# EAGLE schematic hw2 (EAGLE 7.5.0)
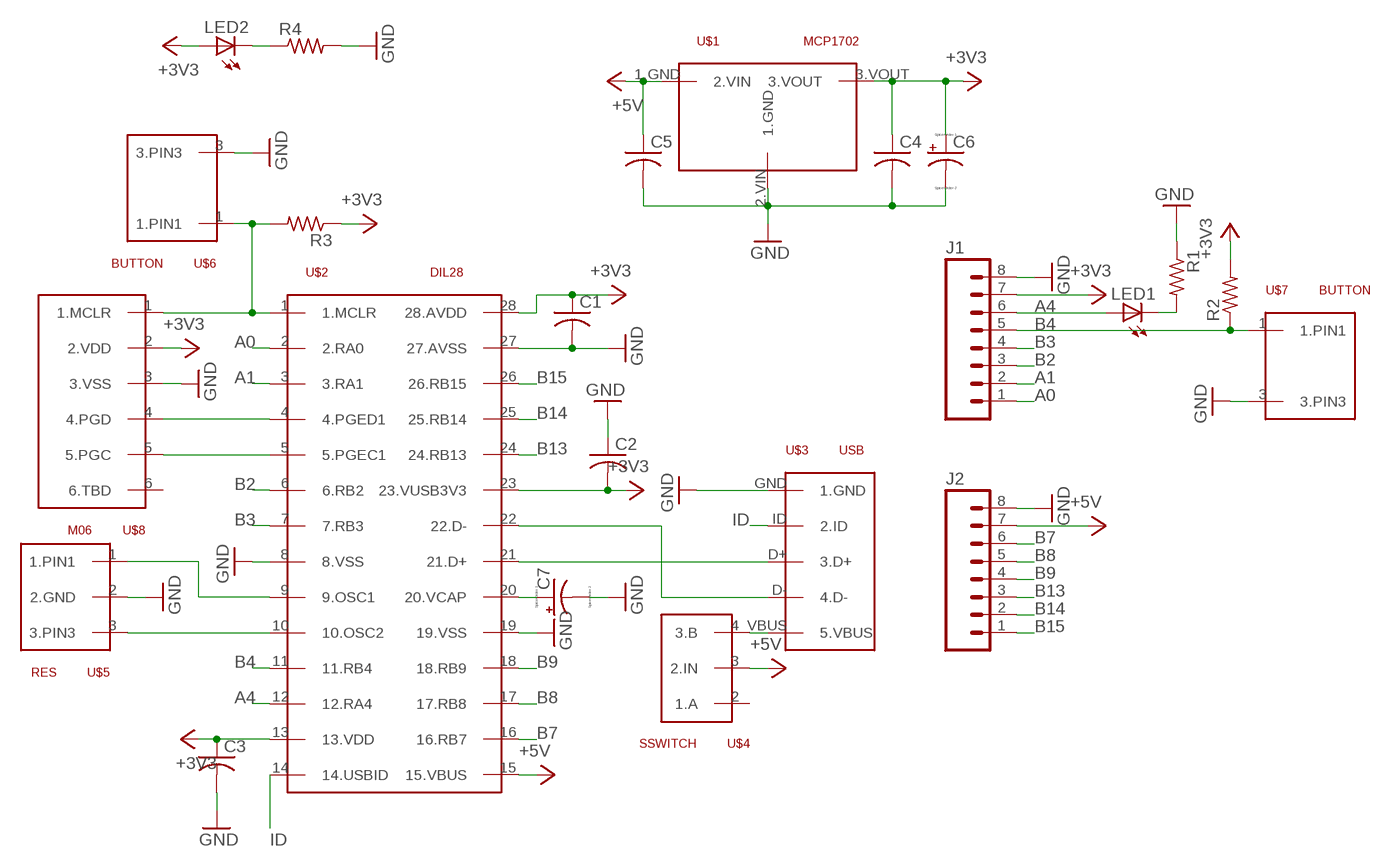
[diagram p0: schematic, sheet 1]

## Parts
C1  C-US025-025X050  [C025-025X050]
C2  C-US025-025X050  [C025-025X050]
C3  C-US025-025X050  [C025-025X050]
C4  C-US025-025X050  [C025-025X050]
C5  C-US025-025X050  [C025-025X050]
C6  CPOL-USTT2D4L  [TT2D4L]
C7  CPOL-USTT2D4L  [TT2D4L]
J1  M08  [1X08_ROUND]
J2  M08  [1X08_ROUND]
LED1  LED3MM  [LED3MM]
LED2  LED3MM  [LED3MM]
R1  R-US_0207/10  [0207/10]
R2  R-US_0207/10  [0207/10]
R3  R-US_0207/10  [0207/10]
R4  R-US_0207/10  [0207/10]
U$1  MCP1702  [TO92]
U$2  DIL28  [DIL28-3]
U$3  USB  [USB-MB-H]
U$4  SSWITCH  [SSWITCH]
U$5  RES  [1X03]
U$6  BUTTON  [BUTTON]
U$7  BUTTON  [BUTTON]
U$8  M06  [1X06]

## Nets
+3V3: C1.1 C2.2 C3.1 C4.1 C6.+ J1.7 LED2.A R2.2 R3.1 U$1.3.VOUT U$2.13(13.VDD) U$2.23(23.VUSB3V3) U$2.28(28.AVDD) U$8.2(2.VDD)
+5V: C5.1 J2.7 U$1.1.GND(2.VIN) U$2.15(15.VBUS) U$4.3(2.IN)
A0: J1.1 U$2.2(2.RA0)
A1: J1.2 U$2.3(3.RA1)
A4: J1.6 LED1.A U$2.12(12.RA4)
B2: J1.3 U$2.6(6.RB2)
B3: J1.4 U$2.7(7.RB3)
B4: J1.5 R2.1 U$2.11(11.RB4) U$7.1(1.PIN1)
B7: J2.6 U$2.16(16.RB7)
B8: J2.5 U$2.17(17.RB8)
B9: J2.4 U$2.18(18.RB9)
B13: J2.3 U$2.24(24.RB13)
B14: J2.2 U$2.25(25.RB14)
B15: J2.1 U$2.26(26.RB15)
GND: C1.2 C2.1 C3.2 C4.2 C5.2 C6.- C7.- J1.8 J2.8 R1.1 R4.2 U$1.2.VIN(1.GND) U$2.8(8.VSS) U$2.19(19.VSS) U$2.27(27.AVSS) U$3.GND(1.GND) U$5.2(2.GND) U$6.3(3.PIN3) U$7.3(3.PIN3) U$8.3(3.VSS)
ID: U$2.14(14.USBID) U$3.ID(2.ID)
N$1: LED1.K(C) R1.2
N$2: LED2.K(C) R4.1
N$3: U$2.9(9.OSC1) U$5.1(1.PIN1)
N$4: U$2.10(10.OSC2) U$5.3(3.PIN3)
N$5: C7.+ U$2.20(20.VCAP)
N$7: U$2.5(5.PGEC1) U$8.5(5.PGC)
N$8: U$2.4(4.PGED1) U$8.4(4.PGD)
N$9: R3.2 U$2.1(1.MCLR) U$6.1(1.PIN1) U$8.1(1.MCLR)
N$11: U$3.VBUS(5.VBUS) U$4.4(3.B)
N$12: U$2.21(21.D+) U$3.D+(3.D+)
N$13: U$2.22(22.D-) U$3.D-(4.D-)
Unconnected: U$4.2(1.A) U$8.6(6.TBD)

## Library data of the parts
C1-C5 = hw2:C-US: CAPACITOR, American symbol
C6 C7 = hw2:CPOL-US: POLARIZED CAPACITOR, American symbol
J1 J2 = hw2:M08: Header 8 Standard 8-pin 0.1" header. Use with straight break away headers (SKU : PRT-00116), right angle break away headers (PRT-00553), swiss pins (PRT-00743), machine pins (PRT-00117), and female headers (PRT-00115).; PROD_ID: CONN-08437
LED1 LED2 = led:LED: LED OSRAM: - CHIPLED LG R971, LG N971, LY N971, LG Q971, LY Q971, LO R971, LY R971 LH N974, LH R974 LS Q976, LO Q976, LY Q976 LO Q996 - Hyper CHIPLED LW Q18S LB Q993, LB Q99A, LB R99A - SideLED LS A670, LO A670, LY A670, LG A670, LP A670 LB A673, LV A673, LT A673, LW A673 LH A674 LY A675 LS A676, LA A676, LO A676, LY A676, LW A676 LS A679, LY A679, LG A679 - Hyper Micro SIDELED® LS Y876, LA Y876, LO Y876, LY Y876 LT Y87S - SmartLED LW L88C, LW L88S LB L89C, LB L89S, LG L890 LS L89K, LO L89K, LY L89K LS L896, LA L896, LO L896, LY L896 - TOPLED LS T670, LO T670, LY T670, LG T670, LP T670 LSG T670, LSP T670, LSY T670, LOP T670, LYG T670 LG T671, LOG T671, LSG T671 LB T673, LV T673, LT T673, LW T673 LH T674 LS T676, LA T676, LO T676, LY T676, LB T676, LH T676, LSB T676, LW T676 LB T67C, LV T67C, LT T67C, LS T67K, LO T67K, LY T67K, LW E67C LS E67B, LA E67B, LO E67B, LY E67B, LB E67C, LV E67C, LT E67C LW T67C LS T679, LY T679, LG T679 LS T770, LO T770, LY T770, LG T770, LP T770 LB T773, LV T773, LT T773, LW T773 LH T774 LS E675, LA E675, LY E675, LS T675 LS T776, LA T776, LO T776, LY T776, LB T776 LHGB T686 LT T68C, LB T68C - Hyper Mini TOPLED® LB M676 - Mini TOPLED Santana® LG M470 LS M47K, LO M47K, LY M47K Source: http://www.osram.convergy.de LUXEON: - LUMILED® LXK2-PW12-R00, LXK2-PW12-S00, LXK2-PW14-U00, LXK2-PW14-V00 LXK2-PM12-R00, LXK2-PM12-S00, LXK2-PM14-U00 LXK2-PE12-Q00, LXK2-PE12-R00, LXK2-PE12-S00, LXK2-PE14-T00, LXK2-PE14-U00 LXK2-PB12-K00, LXK2-PB12-L00, LXK2-PB12-M00, LXK2-PB14-N00, LXK2-PB14-P00, LXK2-PB14-Q00 LXK2-PR12-L00, LXK2-PR12-M00, LXK2-PR14-Q00, LXK2-PR14-R00 LXK2-PD12-Q00, LXK2-PD12-R00, LXK2-PD12-S00 LXK2-PH12-R00, LXK2-PH12-S00 LXK2-PL12-P00, LXK2-PL12-Q00, LXK2-PL12-R00 Source: www.luxeon.com KINGBRIGHT: KA-3528ASYC Source: www.kingbright.com
R1-R4 = hw2:R-US_: RESISTOR, American symbol
U$1 = hw2:MCP1702
U$2 = hw2:DIL28
U$3 = hw2:USB
U$4 = hw2:SSWITCH
U$5 = hw2:RES
U$6 U$7 = hw2:BUTTON
U$8 = hw2:M06